# EAGLE schematic Varella_Std - v.1.0 (EAGLE 9.5.2)
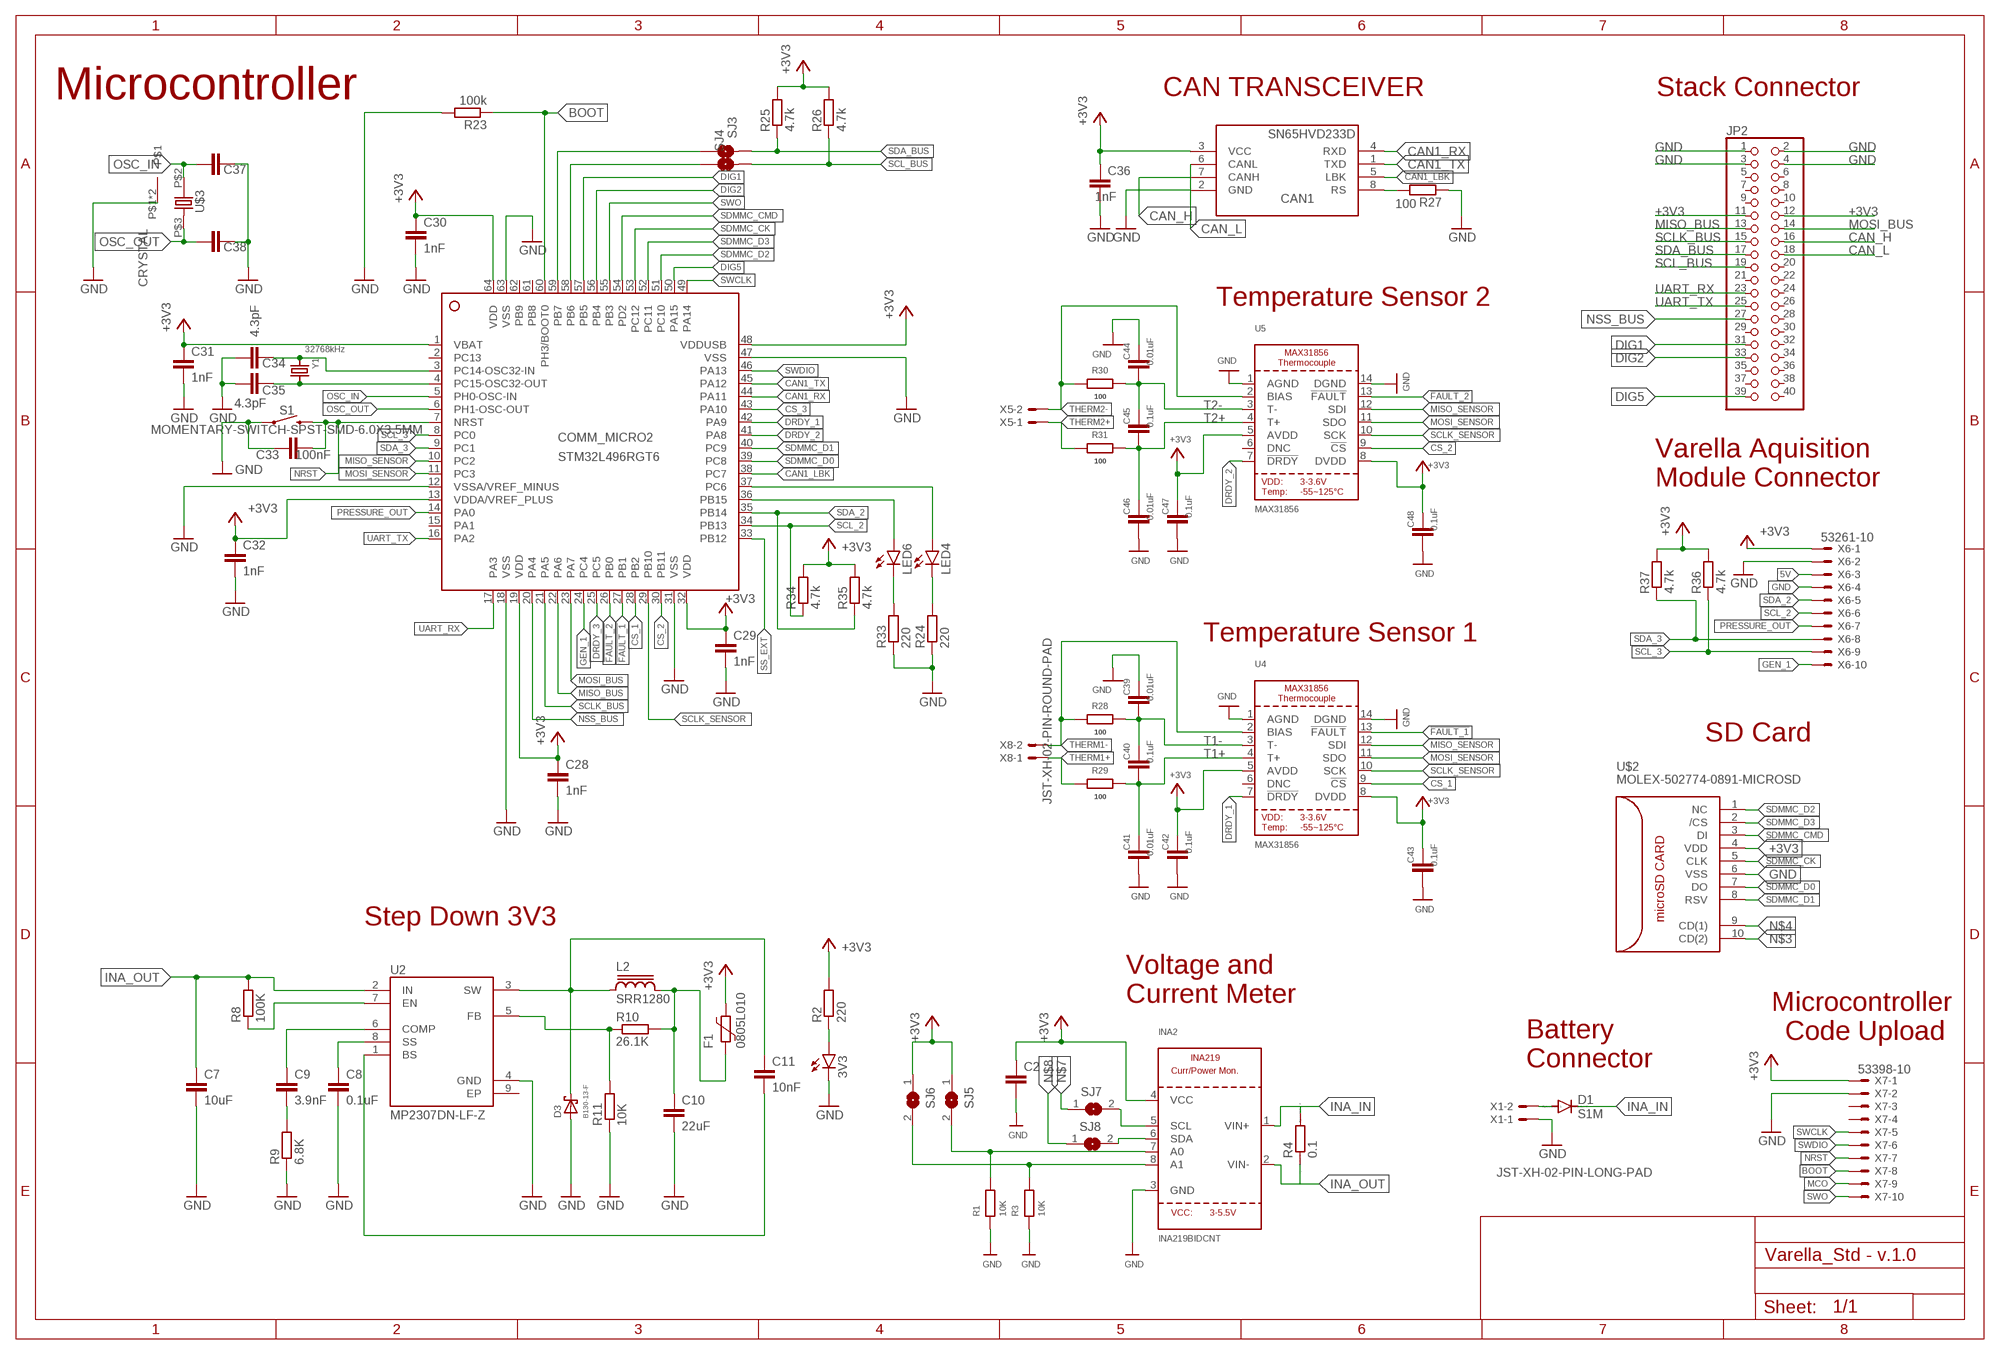
[diagram p0: schematic, sheet 1]

## Parts
3V3  LEDCHIP-LED0805  [CHIP-LED0805]
C2  C-EUC0805  [C0805]
C7  10uF  C-EUC0805  [C0805]
C8  0.1uF  C-EUC0805  [C0805]
C9  3.9nF  C-EUC0805  [C0805]
C10  22uF  C-EUC0805  [C0805]
C11  10nF  C-EUC0805  [C0805]
C28  1nF  C-EUC0805  [C0805]
C29  1nF  C-EUC0805  [C0805]
C30  1nF  C-EUC0805  [C0805]
C31  1nF  C-EUC0805  [C0805]
C32  1nF  C-EUC0805  [C0805]
C33  100nF  C-EUC0805  [C0805]
C34  4.3pF  C-EUC0805  [C0805]
C35  4.3pF  C-EUC0805  [C0805]
C36  1nF  C-EUC0805  [C0805]
C37  C-EUC0805  [C0805]
C38  C-EUC0805  [C0805]
C39  0.01uF  C-EUC0805  [C0805]
C40  0.1uF  C-EUC0805  [C0805]
C41  0.01uF  C-EUC0805  [C0805]
C42  0.1uF  C-EUC0805  [C0805]
C43  0.1uF  C-EUC0805  [C0805]
C44  0.01uF  C-EUC0805  [C0805]
C45  0.1uF  C-EUC0805  [C0805]
C46  0.01uF  C-EUC0805  [C0805]
C47  0.1uF  C-EUC0805  [C0805]
C48  0.1uF  C-EUC0805  [C0805]
CAN1  SN65HVD233D  [SOIC8]
COMM_MICRO2  STM32L496RGT6  [LQFP64_10X10]
D1  S1M  [SMA]
D3  B130-13-F  [SMA]
F1  0805L010  [0805L]
INA2  INA219BIDCNT  INA219  [SOT23-8]
JP2  PINHD-2X20  [2X20]
L2  SRR1280  [SRR1280]
LED4  LEDCHIP-LED0805  [CHIP-LED0805]
LED6  LEDCHIP-LED0805  [CHIP-LED0805]
R1  10K  R-EU_R0805  [R0805]
R2  220  R-EU_R0805  [R0805]
R3  10K  R-EU_R0805  [R0805]
R4  0.1  RR2512  [R2512]
R8  100K  R-EU_R0805  [R0805]
R9  6.8K  R-EU_R0805  [R0805]
R10  26.1K  R-EU_R0805  [R0805]
R11  10K  R-EU_R0805  [R0805]
R23  100k  R-EU_R0805  [R0805]
R24  220  R-EU_R0805  [R0805]
R25  4.7k  R-EU_R0805  [R0805]
R26  4.7k  R-EU_R0805  [R0805]
R27  100  R-EU_R0805  [R0805]
R28  100  R-EU_R0805  [R0805]
R29  100  R-EU_R0805  [R0805]
R30  100  R-EU_R0805  [R0805]
R31  100  R-EU_R0805  [R0805]
R33  220  R-EU_R0805  [R0805]
R34  4.7k  R-EU_R0805  [R0805]
R35  4.7k  R-EU_R0805  [R0805]
R36  4.7k  R-EU_R0805  [R0805]
R37  4.7k  R-EU_R0805  [R0805]
S1  MOMENTARY-SWITCH-SPST-SMD-6.0X3.5MM  [TACTILE_SWITCH_SMD_6.0X3.5MM]
SJ3  SMD-JUMPER-2  [SMD-JUMPER-2]
SJ4  SMD-JUMPER-2  [SMD-JUMPER-2]
SJ5  SOLDERJUMPERREFLOW_NOPASTE  [SOLDERJUMPER_REFLOW_NOPASTE]
SJ6  SOLDERJUMPERREFLOW_NOPASTE  [SOLDERJUMPER_REFLOW_NOPASTE]
SJ7  SOLDERJUMPERREFLOW_NOPASTE  [SOLDERJUMPER_REFLOW_NOPASTE]
SJ8  SOLDERJUMPERREFLOW_NOPASTE  [SOLDERJUMPER_REFLOW_NOPASTE]
U2  MP2307DN-LF-Z  [SOIC127P600X170-9N]
U4  MAX31856  [TSSOP14]
U5  MAX31856  [TSSOP14]
U$2  MOLEX-502774-0891-MICROSD  [MOLEX-502774-0891-MICROSD]
U$3  CRYSTAL  [CRYSTAL_SMD]
X1  JST-XH-02-PIN-LONG-PAD  [JST-XH-02-PACKAGE-LONG-PAD]
X5  JST-XH-02-PIN-ROUND-PAD  [JST-XH-02-PACKAGE-ROUND-PAD]
X6  53261-10  [53261-10]
X7  53398-10  [53398-10]
X8  JST-XH-02-PIN-ROUND-PAD  [JST-XH-02-PACKAGE-ROUND-PAD]
Y1  32768kHz  CRYSTAL8X3.8SMT  [CRYSTAL_8X3.8]

## Nets
5V: X6.3
!FAULT_1: COMM_MICRO2.27(PB1) U4.13(!FAULT)
!FAULT_2: COMM_MICRO2.26(PB0) U5.13(!FAULT)
+3V3: C2.1 C28.1 C29.1 C30.1 C31.1 C32.1 C36.1 C42.1 C43.1 C47.1 C48.1 CAN1.3(VCC) COMM_MICRO2.1(VBAT) COMM_MICRO2.13(VDDA/VREF_PLUS) COMM_MICRO2.19(VDD) COMM_MICRO2.32(VDD) COMM_MICRO2.48(VDDUSB) COMM_MICRO2.64(VDD) F1.1 INA2.4(VCC) JP2.11 JP2.12 R2.2 R25.2 R26.2 R34.2 R35.2 R36.2 R37.2 SJ5.1 SJ6.1 U4.5(AVDD) U4.8(DVDD) U5.5(AVDD) U5.8(DVDD) U$2.4(VDD) X6.1 X7.1
BOOT: COMM_MICRO2.60(PH3/BOOT0) R23.1 X7.8
CAN1_LBK: CAN1.5(LBK) COMM_MICRO2.38(PC7)
CAN1_RX: CAN1.4(RXD) COMM_MICRO2.44(PA11)
CAN1_TX: CAN1.1(TXD) COMM_MICRO2.45(PA12)
CAN_H: CAN1.7(CANH) JP2.16
CAN_L: CAN1.6(CANL) JP2.18
CS_1: COMM_MICRO2.28(PB2) U4.9(!CS)
CS_2: COMM_MICRO2.30(PB11) U5.9(!CS)
CS_3: COMM_MICRO2.43(PA10)
DIG1: COMM_MICRO2.57(PB5) JP2.31
DIG2: COMM_MICRO2.56(PB4) JP2.33
DIG5: COMM_MICRO2.50(PA15) JP2.39
DRDY_1: COMM_MICRO2.42(PA9) U4.7(!DRDY)
DRDY_2: COMM_MICRO2.41(PA8) U5.7(!DRDY)
DRDY_3: COMM_MICRO2.25(PC5)
GEN_1: COMM_MICRO2.24(PC4) X6.10
GND: 3V3.C C2.2 C7.2 C8.2 C10.2 C28.2 C29.2 C30.2 C31.2 C32.2 C33.1 C34.1 C35.1 C36.2 C37.2 C38.2 C39.1 C41.2 C42.2 C43.2 C44.1 C46.2 C47.2 C48.2 CAN1.2(GND) COMM_MICRO2.12(VSSA/VREF_MINUS) COMM_MICRO2.18(VSS) COMM_MICRO2.31(VSS) COMM_MICRO2.47(VSS) COMM_MICRO2.63(VSS) D3.A INA2.3(GND) JP2.1 JP2.2 JP2.3 JP2.4 R1.1 R3.1 R9.1 R11.1 R23.2 R24.1 R27.1 R33.1 S1.1 U2.4(GND) U4.1(AGND) U4.14(DGND) U5.1(AGND) U5.14(DGND) U$2.6(VSS) U$3.P$1 U$3.P$4 X1.1 X6.2 X6.4 X7.2
INA_IN: D1.C INA2.1(VIN+) R4.2
INA_OUT: C7.1 INA2.2(VIN-) R4.1 R8.2 U2.2(IN)
MCO: X7.9
MISO_BUS: COMM_MICRO2.22(PA6) JP2.13
MISO_SENSOR: COMM_MICRO2.10(PC2) U4.12(SDI) U5.12(SDI)
MOSI_BUS: COMM_MICRO2.23(PA7) JP2.14
MOSI_SENSOR: COMM_MICRO2.11(PC3) U4.11(SDO) U5.11(SDO)
N$1: D1.A X1.2
N$2: 3V3.A R2.1
N$3: U$2.10(CD(2))
N$4: U$2.9(CD(1))
N$7: INA2.8(A1) R3.2 SJ6.2 SJ7.1
N$8: INA2.7(A0) R1.2 SJ5.2 SJ8.1
N$9: INA2.5(SCL) SJ7.2
N$10: INA2.6(SDA) SJ8.2
N$13: R8.1 U2.7(EN)
N$14: C9.2 R9.2
N$15: C8.1 U2.8(SS)
N$16: C9.1 U2.6(COMP)
N$17: C11.1 D3.C L2.1 U2.3(SW)
N$18: R10.1 R11.2 U2.5(FB)
N$19: C11.2 U2.1(BS)
N$25: COMM_MICRO2.37(PC6) LED4.A
N$26: LED4.C R24.2
N$27: C34.2 COMM_MICRO2.3(PC14-OSC32-IN) Y1.P$1
N$28: C35.2 COMM_MICRO2.4(PC15-OSC32-OUT) Y1.P$4
N$29: COMM_MICRO2.59(PB7) SJ3.1
N$30: COMM_MICRO2.58(PB6) SJ4.1
N$31: CAN1.8(RS) R27.2
N$34: COMM_MICRO2.36(PB15) LED6.A
N$35: LED6.C R33.2
NRST: C33.2 COMM_MICRO2.7(NRST) S1.2 X7.7
NSS_BUS: COMM_MICRO2.20(PA4) JP2.27
OSC_IN: C37.1 COMM_MICRO2.5(PH0-OSC-IN) U$3.P$2
OSC_OUT: C38.1 COMM_MICRO2.6(PH1-OSC-OUT) U$3.P$3
OUT: C10.1 F1.2 L2.2 R10.2
PRESSURE_OUT: COMM_MICRO2.14(PA0) X6.7
SCL_2: COMM_MICRO2.34(PB13) R34.1 X6.6
SCL_3: COMM_MICRO2.8(PC0) R36.1 X6.9
SCL_BUS: JP2.19 R26.1 SJ4.2
SCLK_BUS: COMM_MICRO2.21(PA5) JP2.15
SCLK_SENSOR: COMM_MICRO2.29(PB10) U4.10(SCK) U5.10(SCK)
SDA_2: COMM_MICRO2.35(PB14) R35.1 X6.5
SDA_3: COMM_MICRO2.9(PC1) R37.1 X6.8
SDA_BUS: JP2.17 R25.1 SJ3.2
SDMMC_CK: COMM_MICRO2.53(PC12) U$2.5(CLK)
SDMMC_CMD: COMM_MICRO2.54(PD2) U$2.3(DI)
SDMMC_D0: COMM_MICRO2.39(PC8) U$2.7(DO)
SDMMC_D1: COMM_MICRO2.40(PC9) U$2.8(RSV)
SDMMC_D2: COMM_MICRO2.51(PC10) U$2.1(NC)
SDMMC_D3: COMM_MICRO2.52(PC11) U$2.2(/CS)
SS_EXT: COMM_MICRO2.33(PB12)
SWCLK: COMM_MICRO2.49(PA14) X7.5
SWDIO: COMM_MICRO2.46(PA13) X7.6
SWO: COMM_MICRO2.55(PB3) X7.10
T1+: C40.2 C41.1 R29.2 U4.4(T+)
T1-: C39.2 C40.1 R28.2 U4.3(T-)
T2+: C45.2 C46.1 R31.2 U5.4(T+)
T2-: C44.2 C45.1 R30.2 U5.3(T-)
THERM1+: R29.1 X8.1
THERM1-: R28.1 U4.2(BIAS) X8.2
THERM2+: R31.1 X5.1
THERM2-: R30.1 U5.2(BIAS) X5.2
UART_RX: COMM_MICRO2.17(PA3) JP2.23
UART_TX: COMM_MICRO2.16(PA2) JP2.25
Unconnected: COMM_MICRO2.2(PC13) COMM_MICRO2.15(PA1) COMM_MICRO2.61(PB8) COMM_MICRO2.62(PB9) JP2.5 JP2.6 JP2.7 JP2.8 JP2.9 JP2.10 JP2.20 JP2.21 JP2.22 JP2.24 JP2.26 JP2.28 JP2.29 JP2.30 JP2.32 JP2.34 JP2.35 JP2.36 JP2.37 JP2.38 JP2.40 U4.6(DNC) U5.6(DNC) X7.3 X7.4

## Notes on the sheet
- CAN TRANSCEIVER | Stack Connector
- Microcontroller
- Temperature Sensor 2
- Varella Aquisition 
  Module Connector
- Temperature Sensor 1
- SD Card
- Step Down 3V3
- Voltage and
  Current Meter
- Microcontroller
   Code Upload
- Battery
  Connector

## Power pins joined to a net without a drawn wire
EP: U2.9(EP)

## Library data of the parts
3V3 LED4 LED6 = led:LED: LED OSRAM: - CHIPLED LG R971, LG N971, LY N971, LG Q971, LY Q971, LO R971, LY R971 LH N974, LH R974 LS Q976, LO Q976, LY Q976 LO Q996 - Hyper CHIPLED LW Q18S LB Q993, LB Q99A, LB R99A - SideLED LS A670, LO A670, LY A670, LG A670, LP A670 LB A673, LV A673, LT A673, LW A673 LH A674 LY A675 LS A676, LA A676, LO A676, LY A676, LW A676 LS A679, LY A679, LG A679 - Hyper Micro SIDELED® LS Y876, LA Y876, LO Y876, LY Y876 LT Y87S - SmartLED LW L88C, LW L88S LB L89C, LB L89S, LG L890 LS L89K, LO L89K, LY L89K LS L896, LA L896, LO L896, LY L896 - TOPLED LS T670, LO T670, LY T670, LG T670, LP T670 LSG T670, LSP T670, LSY T670, LOP T670, LYG T670 LG T671, LOG T671, LSG T671 LB T673, LV T673, LT T673, LW T673 LH T674 LS T676, LA T676, LO T676, LY T676, LB T676, LH T676, LSB T676, LW T676 LB T67C, LV T67C, LT T67C, LS T67K, LO T67K, LY T67K, LW E67C LS E67B, LA E67B, LO E67B, LY E67B, LB E67C, LV E67C, LT E67C LW T67C LS T679, LY T679, LG T679 LS T770, LO T770, LY T770, LG T770, LP T770 LB T773, LV T773, LT T773, LW T773 LH T774 LS E675, LA E675, LY E675, LS T675 LS T776, LA T776, LO T776, LY T776, LB T776 LHGB T686 LT T68C, LB T68C - Hyper Mini TOPLED® LB M676 - Mini TOPLED Santana® LG M470 LS M47K, LO M47K, LY M47K Source: http://www.osram.convergy.de LUXEON: - LUMILED® LXK2-PW12-R00, LXK2-PW12-S00, LXK2-PW14-U00, LXK2-PW14-V00 LXK2-PM12-R00, LXK2-PM12-S00, LXK2-PM14-U00 LXK2-PE12-Q00, LXK2-PE12-R00, LXK2-PE12-S00, LXK2-PE14-T00, LXK2-PE14-U00 LXK2-PB12-K00, LXK2-PB12-L00, LXK2-PB12-M00, LXK2-PB14-N00, LXK2-PB14-P00, LXK2-PB14-Q00 LXK2-PR12-L00, LXK2-PR12-M00, LXK2-PR14-Q00, LXK2-PR14-R00 LXK2-PD12-Q00, LXK2-PD12-R00, LXK2-PD12-S00 LXK2-PH12-R00, LXK2-PH12-S00 LXK2-PL12-P00, LXK2-PL12-Q00, LXK2-PL12-R00 Source: www.luxeon.com KINGBRIGHT: KA-3528ASYC Source: www.kingbright.com
C2 C7-C11 C28-C48 = rcl:C-EU: CAPACITOR, European symbol; SPICEPREFIX: C
CAN1 = SN65HVD233D:SN65HVD233D; AVAILABILITY: Unavailable; DESCRIPTION: 3.3V CAN Transceiver with Standby Mode, Loop-back 8-SOIC -40 to 125; MF: Texas Instruments; MP: SN65HVD233D; PACKAGE: SOIC-8 Texas Instruments; PRICE: None
COMM_MICRO2 = STM32L4xxx:STM32L496R*: STM32L496RX LQFP64 Cortex M4, 80MHz, 512kB-1024kB Flash, 320kB SRAM Datasheet STM32L496XX <http://www.st.com/content/ccc/resource/technical/document/datasheet/group3/3f/73/19/d1/d4/9e/48/34/DM00284211/files/DM00284211.pdf/jcr:content/translations/en.DM00284211.pdf>; FARNELL: 2725138; FLASH: 1024kB; SRAM: 320kB
D1 = diode:S1M
D3 = B130-13-F:B130-13-F; AVAILABILITY: Unavailable; DESCRIPTION: Diode Schottky 30V 1A Surface Mount SMA; MF: Multicomp; MP: B130-13-F; PACKAGE: DO-214 Multicomp; PRICE: None
F1 = polyfuse-smd_10:?: Polyfuse Resettable PTC Source: http://www.littelfuse.com/products/resettable-ptcs.aspx; MF: Littelfuse; MPN: 0805L010; OC_FARNELL: 1832100; OC_NEWARK: 18M4774
INA2 = microbuilder:INA219: INA219 - I2C Current/Power Monitor Voltage Range: 0-26V Accuracy: 0.5% Temperature: -40°C - 125°C
JP2 = pinhead:PINHD-2X20: PIN HEADER
L2 = inductor-bourns:SRR1280: POWER INDUCTOR
R1-R3 R8-R11 R23-R31 R33-R37 = rcl:R-EU_: RESISTOR, European symbol; SPICEPREFIX: R
R4 = eagle-ltspice:R: RESISTOR, European symbol; SPICEMODEL: NONE; SPICEPREFIX: R
S1 = SparkFun-Switches:MOMENTARY-SWITCH-SPST: Momentary Switch (Pushbutton) - SPST Normally-open (NO) SPST momentary switches (buttons, pushbuttons). Variants PTH-12MM - 12mm square, through-hole Momentary Pushbutton Switch - 12mm Square <https://www.sparkfun.com/products/9190> (COM-09190) PTH-6.0MM, PTH-6.0MM-KIT - 6.0mm square, through-hole Mini Pushbutton Switch <https://www.sparkfun.com/products/97> (COM-00097) KIT package intended for soldering kit's - only one side of pads' copper is exposed. PTH-RIGHT-ANGLE-KIT - Right-angle, through-hole Right Angle Tactile Button <https://www.sparkfun.com/products/10791> - Used on SparkFun BigTime Watch Kit <https://www.sparkfun.com/products/11734> SMD-12MM - 12mm square, surface-mount Tactile Button - SMD (12mm) <https://www.sparkfun.com/products/12993> (COM-12993) Used on SparkFun PicoBoard <https://www.sparkfun.com/products/11888> SMD-4.5MM - 4.5mm Square Trackball Switch Used on SparkFun Blackberry Trackballer Breakout <https://www.sparkfun.com/products/13169> SMD-4.6MMX2.8MM - 4.60mm x 2.80mm, surface mount Used on SparkFun SAMD21 Mini Breakout <https://www.sparkfun.com/products/13664> SMD-5.2MM, SMD-5.2-REDUNDANT - 5.2mm square, surface-mount Mini Pushbutton Switch - SMD <https://www.sparkfun.com/products/8720> (COM-08720) Used on Arduino Pro Mini <https://www.sparkfun.com/products/11114> REDUNDANT package connects both switch circuits together SMD-6.0X3.5MM - 6.0 x 3.5mm, surface mount Momentary Reset Switch SMD <https://www.sparkfun.com/products/8229> (COM-08229) SMD-6.2MM-TALL - 6.2mm square, surface mount Tactile Button - SMD (6mm) <https://www.sparkfun.com/products/12992> Used on SparkFun Digital Sandbox <https://www.sparkfun.com/products/12651> SMD-RIGHT-ANGLE - Right-angle, surface mount Used on SparkFun Block for Intel® Edison - Arduino <https://www.sparkfun.com/products/13036>; PROD_ID: SWCH-00815; SF_SKU: COM-08229
SJ3 SJ4 = FaBo-PIN:SMD-JUMPER-2
SJ5-SJ8 = microbuilder:SOLDERJUMPER: SMD Solder JUMPER Solder the two pads together to create a connection, or remove the solder to break it. REFLOW - Use this footprint for solder paste and reflow ovens. WAVE - Use this footprint for hand-soldering (larger pads). CLOSED - Has a trace between the two pads to ensure it is closed by default. The trace needs to be cut to disable the jumper, and can be closed again by creating a solder bridge between the two pads.
U2 = MP2307DN-LF-Z:MP2307DN-LF-Z: MP2307 Series 23 V 3 A 380 KHz Synchronous Rectified Step-Down Converter-SOIC-8; AVAILABILITY: Unavailable; DESCRIPTION: Buck Switching Regulator IC Positive Adjustable 0.925V 1 Output 3A 8-SOIC _0.154, 3.90mm Width_ Exposed Pad; MF: Monolithic Power; MP: MP2307DN-LF-Z; PACKAGE: SOIC-8 Monolithic Power; PRICE: None
U4 U5 = microbuilder:MAX31856: MAX31856 - Thermocouple Sensor ADC
U$2 = Ava:MOLEX-502774-0891-MICROSD; FARNELL: 2064063
U$3 = cristal:CRYSTAL
X1 X5 X8 = JST-XH-Zenith:JST-XH-02-PIN: JST XH Connector 2 Pin Wire to board connector. Pitch: 2,54 mm, (0.100") Number of pins: 2 Created by Rembrandt Electronics www.rembrandtelectronics.com
X6 = con-zenith:53?-10: CONNECTOR wire to board 1.25 mm (.049 inch) pitch header; MF: MOLEX; OC_FARNELL: unknown; OC_NEWARK: unknown
X7 = con-molex:53?-10: CONNECTOR wire to board 1.25 mm (.049 inch) pitch header; MF: MOLEX; MPN: 53398-1071; OC_FARNELL: unknown; OC_NEWARK: 59J0425
Y1 = microbuilder:CRYSTAL: Crystals HC49UP - Surface Mount Crystal 4.0MHz 18pF +/-30ppm Surface Mount Crystal [Digikey: 535-9857-1-ND] 12.0 MHz Surface Mount Crystal [Digikey: 535-9869-6-ND] 25.0 MHz Surface Mount Crystal [Digikey: 535-9078-1-ND] 2.5 x 2.0mm - MEMs SMT Crystal 16.0 MHz 10pF 20ppm 2.5 x 2.0mm Crystal [Digikey -40-85°C: 535-10923-1-ND] 3.2 x 2.5mm - MEMs SMT Crystal 12.0 MHz 8pF 15ppm 3.2 x 2.5mm Crystal [Digikey: -10-70°C: 644-1047-1-ND -40-125°C: 644-1128-1-ND] 16.0 MHz 8pF 15ppm 3.2 x 2.5mm Crystal [Digikey: -10-70°C: 644-1049-1-ND -40-125°C: 644-1129-2-ND] 16.0 MHz 10pF 10ppm 3.2 x 2.5mm Crystal [Digikey: 644-1100-1-ND] 27.12 MHz 18pF 30ppm 3.2 x 2.5mm Crystal [Digikey: 887-1424-1-ND] 27.12MHz 10pF 10ppm 3.2 x 2.5mm Crystal [Digikey: 887-1329-1-ND] 4.9 x 1.8mm - MEMs SMT Crystal 32.768 KHz 12.5pF 20ppm 4.9 x 1.8mm Crystal [Digikey: SE2415CT-ND] 8.0 x 3.8mm - Surface Mount Crystal 32.768kHz 12.5pF 20ppm -40°C-85°C [Digikey: 535-9166-2-ND] Cylinder 32.768KHz Cylinder Crystal (2x6mm body) [Ex. Digikey: 300-8341-2-ND]